# EAGLE schematic FuzzOfWar (EAGLE 9.5.2)
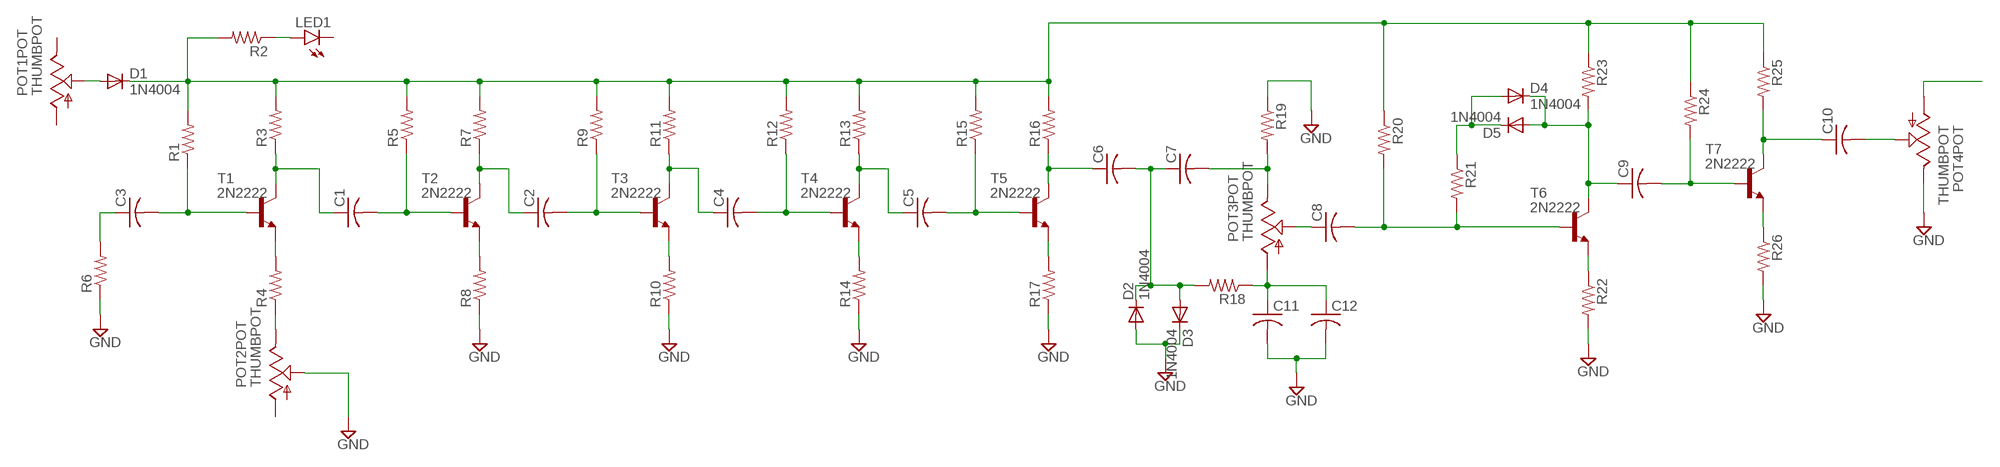
[diagram p0: schematic, sheet 1]

## Parts
C1  C-USC0603  [C0603]
C2  C-USC0603  [C0603]
C3  C-USC0603  [C0603]
C4  C-USC0603  [C0603]
C5  C-USC0603  [C0603]
C6  C-USC0603  [C0603]
C7  C-USC0603  [C0603]
C8  C-USC0603  [C0603]
C9  C-USC0603  [C0603]
C10  C-USC0603  [C0603]
C11  C-USC0603  [C0603]
C12  C-USC0603  [C0603]
D1  1N4004  [DO41-10]
D2  1N4004  [DO41-10]
D3  1N4004  [DO41-10]
D4  1N4004  [DO41-10]
D5  1N4004  [DO41-10]
LED1  LED3MM  [LED3MM]
POT1  THUMBPOT  [THUMBWHEEL]
POT2  THUMBPOT  [THUMBWHEEL]
POT3  THUMBPOT  [THUMBWHEEL]
POT4  THUMBPOT  [THUMBWHEEL]
R1  R-US_R0603  [R0603]
R2  R-US_R0603  [R0603]
R3  R-US_R0603  [R0603]
R4  R-US_R0603  [R0603]
R5  R-US_R0603  [R0603]
R6  R-US_R0603  [R0603]
R7  R-US_R0603  [R0603]
R8  R-US_R0603  [R0603]
R9  R-US_R0603  [R0603]
R10  R-US_R0603  [R0603]
R11  R-US_R0603  [R0603]
R12  R-US_R0603  [R0603]
R13  R-US_R0603  [R0603]
R14  R-US_R0603  [R0603]
R15  R-US_R0603  [R0603]
R16  R-US_R0603  [R0603]
R17  R-US_R0603  [R0603]
R18  R-US_R0603  [R0603]
R19  R-US_R0603  [R0603]
R20  R-US_R0603  [R0603]
R21  R-US_R0603  [R0603]
R22  R-US_R0603  [R0603]
R23  R-US_R0603  [R0603]
R24  R-US_R0603  [R0603]
R25  R-US_R0603  [R0603]
R26  R-US_R0603  [R0603]
T1  2N2222  [TO92-EBC-OVAL]
T2  2N2222  [TO92-EBC-OVAL]
T3  2N2222  [TO92-EBC-OVAL]
T4  2N2222  [TO92-EBC-OVAL]
T5  2N2222  [TO92-EBC-OVAL]
T6  2N2222  [TO92-EBC-OVAL]
T7  2N2222  [TO92-EBC-OVAL]

## Nets
GND: C11.2 C12.2 D2.A D3.C POT2.2(POT:S) POT4.3(POT:E) R6.1 R8.1 R10.1 R14.1 R17.1 R19.1 R22.2 R26.2
N$1: C3.1 R6.2
N$2: C3.2 R1.1 T1.B
N$3: D1.C R1.2 R2.2 R3.2 R5.2 R7.2 R9.2 R11.2 R12.2 R13.2 R15.2 R16.2 R20.1 R23.1 R24.1 R25.1
N$4: D1.A POT1.2(POT:S)
N$5: LED1.A R2.1
N$6: C1.1 R3.1 T1.C
N$7: R4.2 T1.E
N$8: POT2.3(POT:E) R4.1
N$9: C1.2 R5.1 T2.B
N$10: C2.1 R7.1 T2.C
N$11: R8.2 T2.E
N$12: C2.2 R9.1 T3.B
N$13: R10.2 T3.E
N$14: C4.1 R11.1 T3.C
N$15: C4.2 R12.1 T4.B
N$16: C5.1 R13.1 T4.C
N$17: R14.2 T4.E
N$18: C5.2 R15.1 T5.B
N$19: C6.1 R16.1 T5.C
N$20: R17.2 T5.E
N$21: C6.2 C7.1 D2.C D3.A R18.2
N$22: C11.1 C12.1 POT3.1(POT:A) R18.1
N$23: C7.2 POT3.3(POT:E) R19.2
N$24: C8.1 POT3.2(POT:S)
N$25: C8.2 R20.2 R21.2 T6.B
N$26: C9.2 R24.2 T7.B
N$27: D4.A D5.C R21.1
N$28: C9.1 D4.C D5.A R23.2 T6.C
N$29: R22.1 T6.E
N$30: C10.1 R25.2 T7.C
N$31: R26.1 T7.E
N$32: C10.2 POT4.2(POT:S)
N$33: POT4.1(POT:A)
Unconnected: LED1.K(C) POT1.1(POT:A) POT1.3(POT:E) POT1.SW1(SW:S) POT1.SW2(SW:P) POT2.1(POT:A) POT2.SW1(SW:S) POT2.SW2(SW:P) POT3.SW1(SW:S) POT3.SW2(SW:P) POT4.SW1(SW:S) POT4.SW2(SW:P)

## Library data of the parts
C1-C12 = rcl:C-US: CAPACITOR, American symbol; SPICEPREFIX: C
D1-D5 = adafruit:1N4004: DIODE General purpose 1N400x type rectifier (With bigger pads) http://www.ladyada.net/library/pcb/eaglelibrary.html
LED1 = led:LED: LED OSRAM: - CHIPLED LG R971, LG N971, LY N971, LG Q971, LY Q971, LO R971, LY R971 LH N974, LH R974 LS Q976, LO Q976, LY Q976 LO Q996 - Hyper CHIPLED LW Q18S LB Q993, LB Q99A, LB R99A - SideLED LS A670, LO A670, LY A670, LG A670, LP A670 LB A673, LV A673, LT A673, LW A673 LH A674 LY A675 LS A676, LA A676, LO A676, LY A676, LW A676 LS A679, LY A679, LG A679 - Hyper Micro SIDELED® LS Y876, LA Y876, LO Y876, LY Y876 LT Y87S - SmartLED LW L88C, LW L88S LB L89C, LB L89S, LG L890 LS L89K, LO L89K, LY L89K LS L896, LA L896, LO L896, LY L896 - TOPLED LS T670, LO T670, LY T670, LG T670, LP T670 LSG T670, LSP T670, LSY T670, LOP T670, LYG T670 LG T671, LOG T671, LSG T671 LB T673, LV T673, LT T673, LW T673 LH T674 LS T676, LA T676, LO T676, LY T676, LB T676, LH T676, LSB T676, LW T676 LB T67C, LV T67C, LT T67C, LS T67K, LO T67K, LY T67K, LW E67C LS E67B, LA E67B, LO E67B, LY E67B, LB E67C, LV E67C, LT E67C LW T67C LS T679, LY T679, LG T679 LS T770, LO T770, LY T770, LG T770, LP T770 LB T773, LV T773, LT T773, LW T773 LH T774 LS E675, LA E675, LY E675, LS T675 LS T776, LA T776, LO T776, LY T776, LB T776 LHGB T686 LT T68C, LB T68C - Hyper Mini TOPLED® LB M676 - Mini TOPLED Santana® LG M470 LS M47K, LO M47K, LY M47K Source: http://www.osram.convergy.de LUXEON: - LUMILED® LXK2-PW12-R00, LXK2-PW12-S00, LXK2-PW14-U00, LXK2-PW14-V00 LXK2-PM12-R00, LXK2-PM12-S00, LXK2-PM14-U00 LXK2-PE12-Q00, LXK2-PE12-R00, LXK2-PE12-S00, LXK2-PE14-T00, LXK2-PE14-U00 LXK2-PB12-K00, LXK2-PB12-L00, LXK2-PB12-M00, LXK2-PB14-N00, LXK2-PB14-P00, LXK2-PB14-Q00 LXK2-PR12-L00, LXK2-PR12-M00, LXK2-PR14-Q00, LXK2-PR14-R00 LXK2-PD12-Q00, LXK2-PD12-R00, LXK2-PD12-S00 LXK2-PH12-R00, LXK2-PH12-S00 LXK2-PL12-P00, LXK2-PL12-Q00, LXK2-PL12-R00 Source: www.luxeon.com KINGBRIGHT: KA-3528ASYC Source: www.kingbright.com
POT1-POT4 = adafruit:THUMBPOT: Thumbwheel pot with switch Available in horizontal (Alpha RV121SF) or vertical (Xicon 311-1701)
R1-R26 = rcl:R-US_: RESISTOR, American symbol; SPICEPREFIX: R
T1-T7 = adafruit:2N2222: NPN TRANSISTOR Big oval pads